# EAGLE design rapidshark-dart-detector-mk-1.1 (EAGLE 6.5.0)
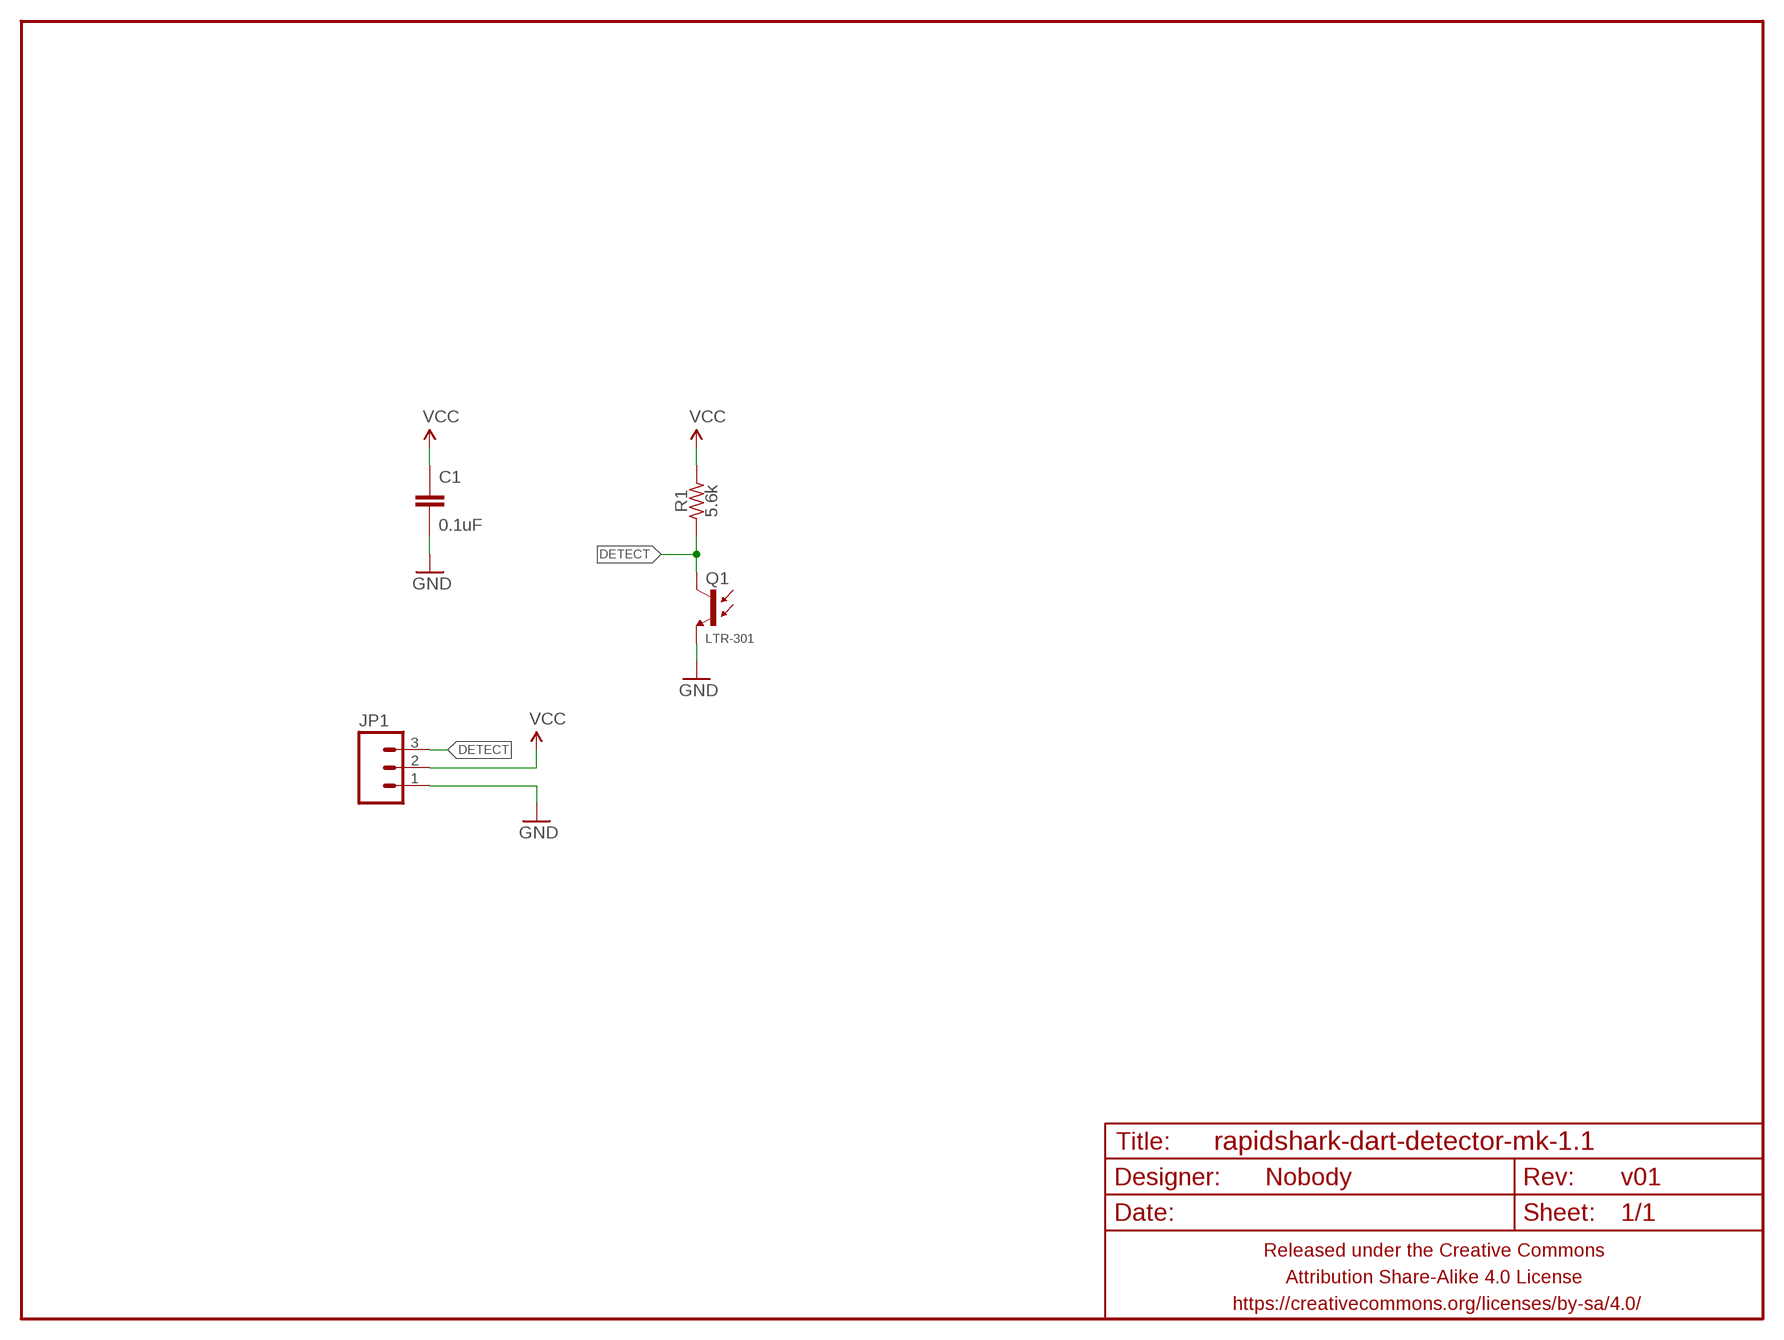
[diagram p0: schematic, sheet 1]

## Parts
C1  0.1uF  CAPACITOR-CERAMIC025-024X044  [C025-024X044]
FRAME1  FRAME-LETTERNO_PACKAGE  [DUMMY]
JP1  M03JST-PTH  [JST-3-PH-RA-PTH]
Q1  LTR-301  PHOTOTRANSISTOR2.54MM-SIDE  [LED-2.54MM-SIDE]
R1  5.6k  RESISTORPTH-AXIAL-6.35MM  [RESISTOR-AXIAL-PTH-6.35MM]

## Nets
DETECT: JP1.3 Q1.A(C) R1.P$1
GND: C1.2 JP1.1 Q1.K(E)
VCC: C1.1 JP1.2 R1.P$2

## Library data of the parts
C1 = A_butts:CAPACITOR-CERAMIC: CAPACITOR, European symbol
FRAME1 = A_butts:FRAME-LETTER: Schematic Frame Standard 8.5x11 US Letter frame; DESIGNER: Nobody; VERSION: v01
JP1 = A_butts:M03: Header 3 Standard 3-pin 0.1" header. Use with straight break away headers (SKU : PRT-00116), right angle break away headers (PRT-00553), swiss pins (PRT-00743), machine pins (PRT-00117), and female headers (PRT-00115). Molex polarized connector foot print use with SKU : PRT-08232 with associated crimp pins and housings.; SKU: PRT-09915
Q1 = A_butts:PHOTOTRANSISTOR
R1 = A_butts:RESISTOR: RESISTOR, American symbol

## Board
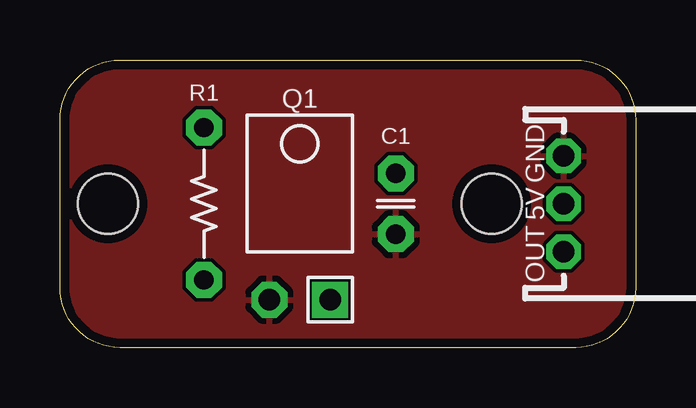
[diagram p1: board, top side]
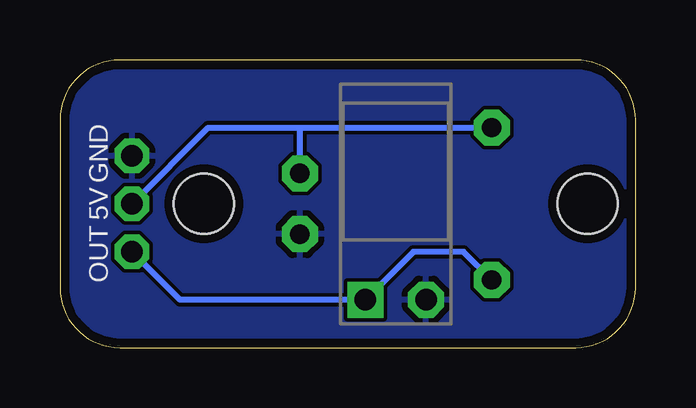
[diagram p2: board, bottom side, seen from below]

Size 24 x 12 mm. Coordinates in mm from the lower left corner, seen from the top.
Outline: 2.5,12 21.5,12 arc-90 24,9.5 24,2.5 arc-90 21.5,0 2.5,0 arc-90 0,2.5 0,9.5 arc-90 2.5,12
Copper layers (1*16): Top 0.0356mm / dielectric 1.5011mm / Bottom 0.0356mm
Design rules "LaenPCBOrder_2": minimum track width 6mil, minimum drill 13mil, track to track 6mil, track to pad 6mil, pad to pad 6mil, via to via 6mil, smd to smd 6mil, copper to edge 15mil, drill to drill 6mil, minimum pad ring 7mil, minimum via ring 7mil, stop-mask expansion 3mil, vias tented up to drill 20mil, thermal gap 10mil
Holes 2.5 mm at 2,6 18,6

### Footprints (pad centres in the part's own frame; a part is rotated, then mirrored left to right if it is on the bottom)
C025-024X044 = drill 0.813 pad 1.5 octagon: 1 -1.27,0; 2 1.27,0
JST-3-PH-RA-PTH = drill 0.9 pad 1.422 octagon: 1 -2,0; 2 0,0; 3 2,0
LED-2.54MM-SIDE = drill 0.9 pad 1.5 square: A 1.27,0 | drill 0.9 pad 1.5 octagon: K -1.27,0
RESISTOR-AXIAL-PTH-6.35MM = drill 0.8 pad 1.5 octagon: P$1 -3.175,0; P$2 3.175,0

### Placement (x,y rotation side)
C1  14,6 270 top
FRAME1  0,12 180 bottom
JP1  21,6 270 top
Q1  10,2 0 top
R1  6,6 90 top

### Tracks (layer width: path | path; a pad name or v marks a point on that pad's centre or on a via)
DETECT
  Bottom 0.25: JP1.3 19,2 Q1.A 9.27,4 7.17,4 R1.P$1
GND
  pour Top (rank 5): 0,12 0,0 24,0 24,12
  pour Bottom (rank 5): 0,12 0,0 24,0 24,12
VCC
  Bottom 0.25: JP1.2 17.82,9.18 14,9.18 | 14,9.18 R1.P$2 | C1.1 14,9.18

### Text on the board
tPlace: GND | 5V | OUT
bPlace: GND | 5V | OUT